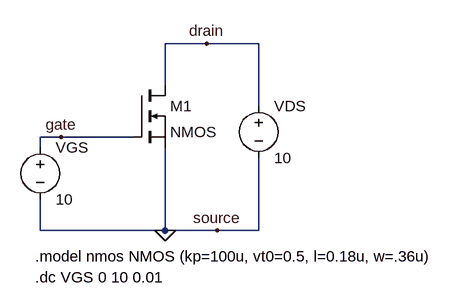
[diagram p0: schematic part1_b.asc]
part1_b.asc, the LTspice schematic file:
Version 4
SHEET 1 880 680
WIRE 160 48 96 48
WIRE 240 48 160 48
WIRE 96 112 96 48
WIRE 240 144 240 48
WIRE -64 192 -96 192
WIRE 48 192 -64 192
WIRE -96 208 -96 192
WIRE -96 336 -96 288
WIRE 96 336 96 208
WIRE 96 336 -96 336
WIRE 176 336 96 336
WIRE 240 336 240 224
WIRE 240 336 176 336
FLAG 96 336 0
FLAG -64 192 gate
FLAG 160 48 drain
FLAG 176 336 source
SYMBOL voltage -96 192 R0
SYMATTR InstName VGS
SYMATTR Value 10
SYMBOL voltage 240 128 R0
SYMATTR InstName VDS
SYMATTR Value 10
SYMBOL nmos 48 112 R0
SYMATTR InstName M1
TEXT -104 376 Left 2 !.model nmos NMOS (kp=100u, vt0=0.5, l=0.18u, w=.36u)
TEXT -104 408 Left 2 !.dc VGS 0 10 0.01

The netlist it stands for:
* part1_b.asc
VGS gate 0 10
VDS drain 0 10
M1 drain gate 0 0 NMOS
.model NMOS NMOS
.model PMOS PMOS
.lib standard.mos
.model nmos NMOS (kp=100u, vt0=0.5, l=0.18u, w=.36u)
.dc VGS 0 10 0.01
.backanno
.end

* Results of the author's LTspice run, read from the files saved beside the schematic
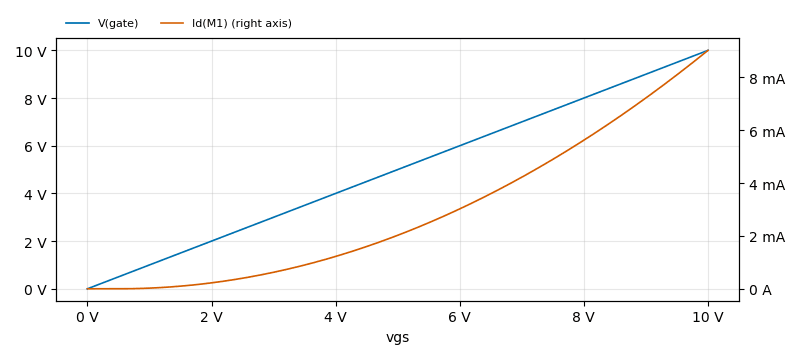
[diagram p1: DC transfer characteristic of part1_b.asc, plotted from the saved traces]
* DC transfer characteristic, 1 run:
*   V(gate): 0 V at vgs=0 V, 10 V at vgs=10 V, min 0 V, max 10 V
*   Id(M1): 20.01 pA at vgs=0 V, 9.025 mA at vgs=10 V, min 20.01 pA, max 9.025 mA